# Altium schematic sheet ip-mic.SchDoc
size A4
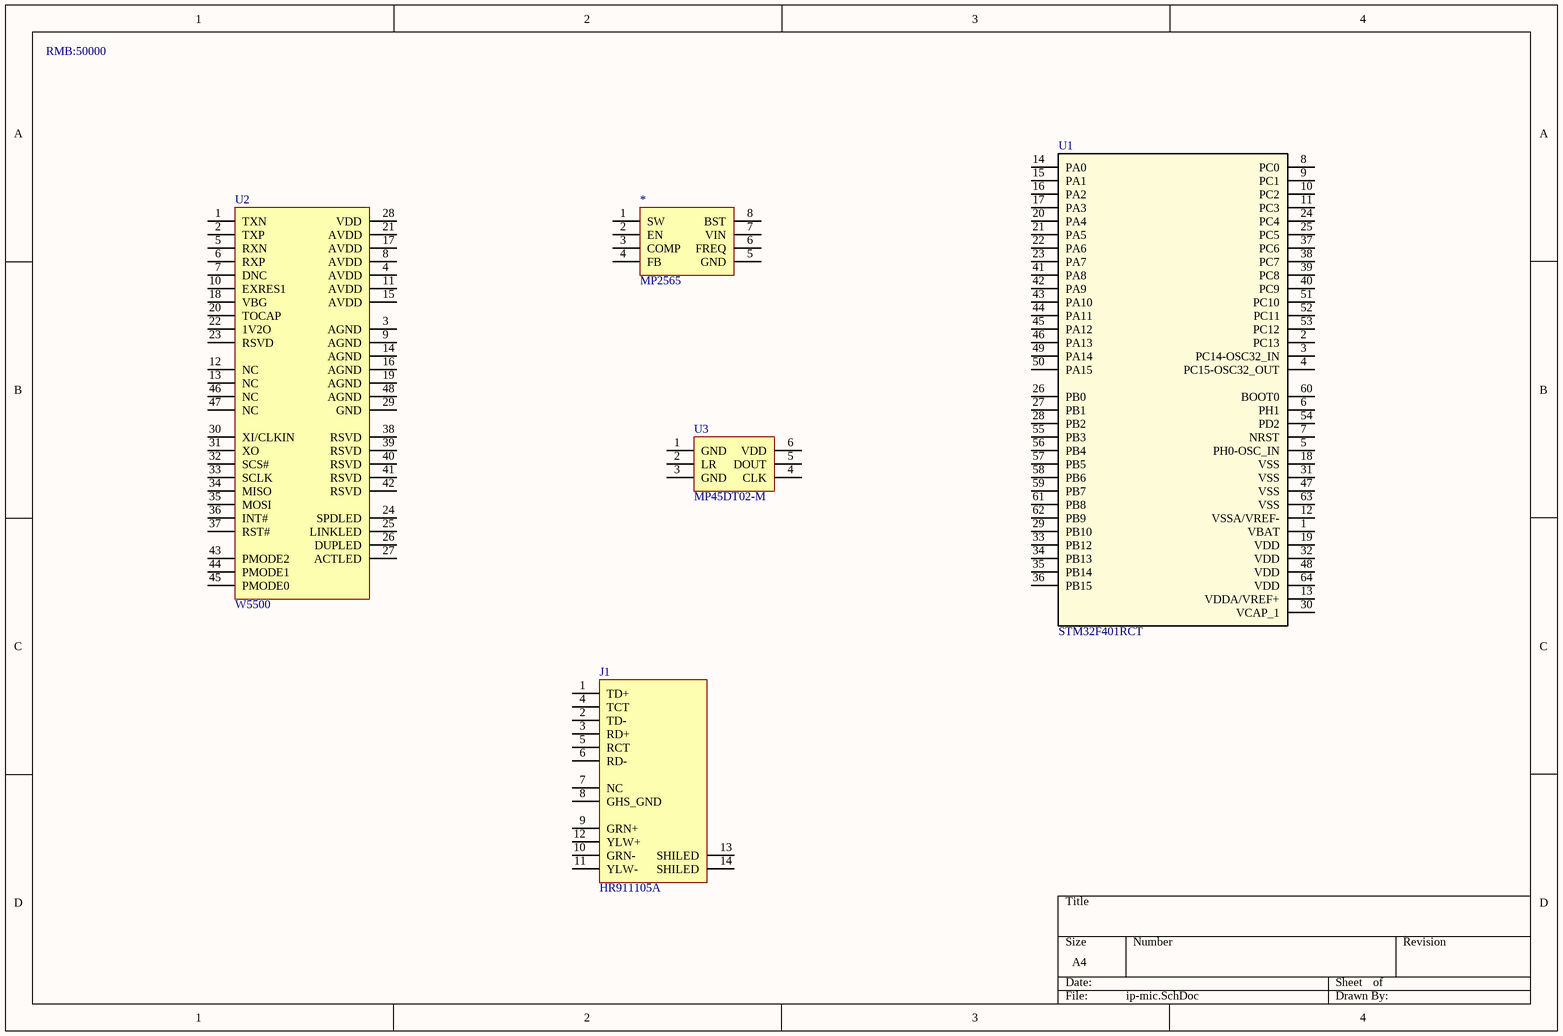
[diagram p0: ip-mic.SchDoc]

## Parts
*  MP2565  [SOIC8E]
J1  HR911105A  [HR911105A]
U1  STM32F401RCT  [LQFP64-10x10]
U2  W5500  [LQFP48-7x7]
U3  MP45DT02-M  [MP45DT02-M]

## Nets

Not connected (* = marked no-connect by the designer): * 1(SW) 2(EN) 3(COMP) 4(FB) 5(GND) 6(FREQ) 7(VIN) 8(BST); J1 1(TD+) 2(TD-) 3(RD+) 4(TCT) 5(RCT) 6(RD-) 7(NC) 8(GHS_GND) 9(GRN+) 10(GRN-) 11(YLW-) 12(YLW+) 13(SHILED) 14(SHILED); U1 1(VBAT) 2(PC13) 3(PC14-OSC32_IN) 4(PC15-OSC32_OUT) 5(PH0-OSC_IN) 6(PH1) 7(NRST) 8(PC0) 9(PC1) 10(PC2) 11(PC3) 12(VSSA/VREF-) 13(VDDA/VREF+) 14(PA0) 15(PA1) 16(PA2) 17(PA3) 18(VSS) 19(VDD) 20(PA4) 21(PA5) 22(PA6) 23(PA7) 24(PC4) 25(PC5) 26(PB0) 27(PB1) 28(PB2) 29(PB10) 30(VCAP_1) 31(VSS) 32(VDD) 33(PB12) 34(PB13) 35(PB14) 36(PB15) 37(PC6) 38(PC7) 39(PC8) 40(PC9) 41(PA8) 42(PA9) 43(PA10) 44(PA11) 45(PA12) 46(PA13) 47(VSS) 48(VDD) 49(PA14) 50(PA15) 51(PC10) 52(PC11) 53(PC12) 54(PD2) 55(PB3) 56(PB4) 57(PB5) 58(PB6) 59(PB7) 60(BOOT0) 61(PB8) 62(PB9) 63(VSS) 64(VDD); U2 1(TXN) 2(TXP) 3(AGND) 4(AVDD) 5(RXN) 6(RXP) 7(DNC) 8(AVDD) 9(AGND) 10(EXRES1) 11(AVDD) 12(NC) 13(NC) 14(AGND) 15(AVDD) 16(AGND) 17(AVDD) 18(VBG) 19(AGND) 20(TOCAP) 21(AVDD) 22(1V2O) 23(RSVD) 24(SPDLED) 25(LINKLED) 26(DUPLED) 27(ACTLED) 28(VDD) 29(GND) 30(XI/CLKIN) 31(XO) 32(SCS#) 33(SCLK) 34(MISO) 35(MOSI) 36(INT#) 37(RST#) 38(RSVD) 39(RSVD) 40(RSVD) 41(RSVD) 42(RSVD) 43(PMODE2) 44(PMODE1) 45(PMODE0) 46(NC) 47(NC) 48(AGND); U3 1(GND) 2(LR) 3(GND) 4(CLK) 5(DOUT) 6(VDD)

## Notes on the sheet
- RMB:50000

## Library data of the parts
* = MP2565: 50V  Step-Down Converter
J1 = HR911105A: RG45  HR911105A.pdf
U1 = STM32F401RCT: 适用于F401RBT 或RCT (RD/RD 可能不适用)
U3 = MP45DT02-M: digital microphone